# Altium schematic sheet Senser.SchDoc
size A4
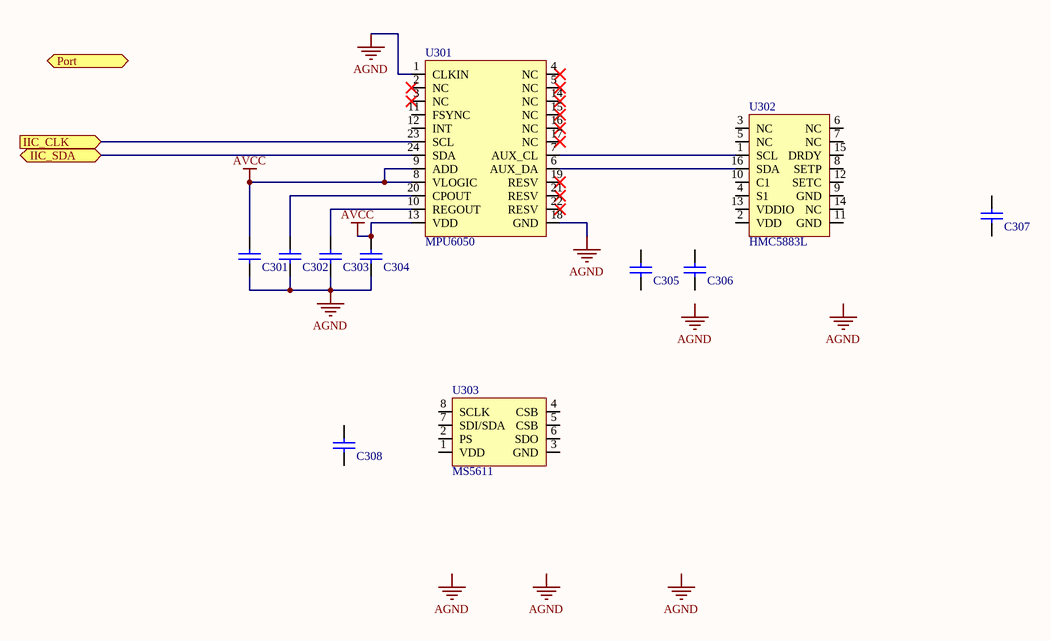
[diagram p0: Senser.SchDoc]

## Parts
C301  Cap 0603  (value not drawn)
C302  Cap 0603  (value not drawn)
C303  Cap 0603  (value not drawn)
C304  Cap 0603  (value not drawn)
C305  Cap 0603  (value not drawn)
C306  Cap 0603  (value not drawn)
C307  Cap 0603  (value not drawn)
C308  Cap 0603  (value not drawn)
U301  MPU6050
U302  HMC5883L
U303  MS5611

## Ports
IIC_CLK (in), IIC_SDA (bidir), Port

## Nets
AGND: C301.1 C302.1 C303.1 C304.1 U301.1(CLKIN) U301.18(GND)
AVCC: C301.2 C304.2 U301.8(VLOGIC) U301.9(ADD) U301.13(VDD)
IIC_CLK: U301.23(SCL) ; port IIC_CLK
IIC_SDA: U301.24(SDA) ; port IIC_SDA
NetC302_2: C302.2 U301.20(CPOUT)
NetC303_2: C303.2 U301.10(REGOUT)
NetU301_6: U301.6(AUX_DA) U302.16(SDA)
NetU301_7: U301.7(AUX_CL) U302.1(SCL)

Not connected (* = marked no-connect by the designer): C305 1 2; C306 1 2; C307 1 2; C308 1 2; U301 2(NC)* 3(NC)* 4(NC)* 5(NC)* 11(FSYNC) 12(INT) 14(NC)* 15(NC)* 16(NC)* 17(NC)* 19(RESV)* 21(RESV)* 22(RESV)*; U302 2(VDD) 3(NC) 4(S1) 5(NC) 6(NC) 7(NC) 8(SETP) 9(GND) 10(C1) 11(GND) 12(SETC) 13(VDDIO) 14(NC) 15(DRDY); U303 1(VDD) 2(PS) 3(GND) 4(CSB) 5(CSB) 6(SDO) 7(SDI/SDA) 8(SCLK)

## Notes on the sheet
- Labels drawn without touching a wire or pin: AGND